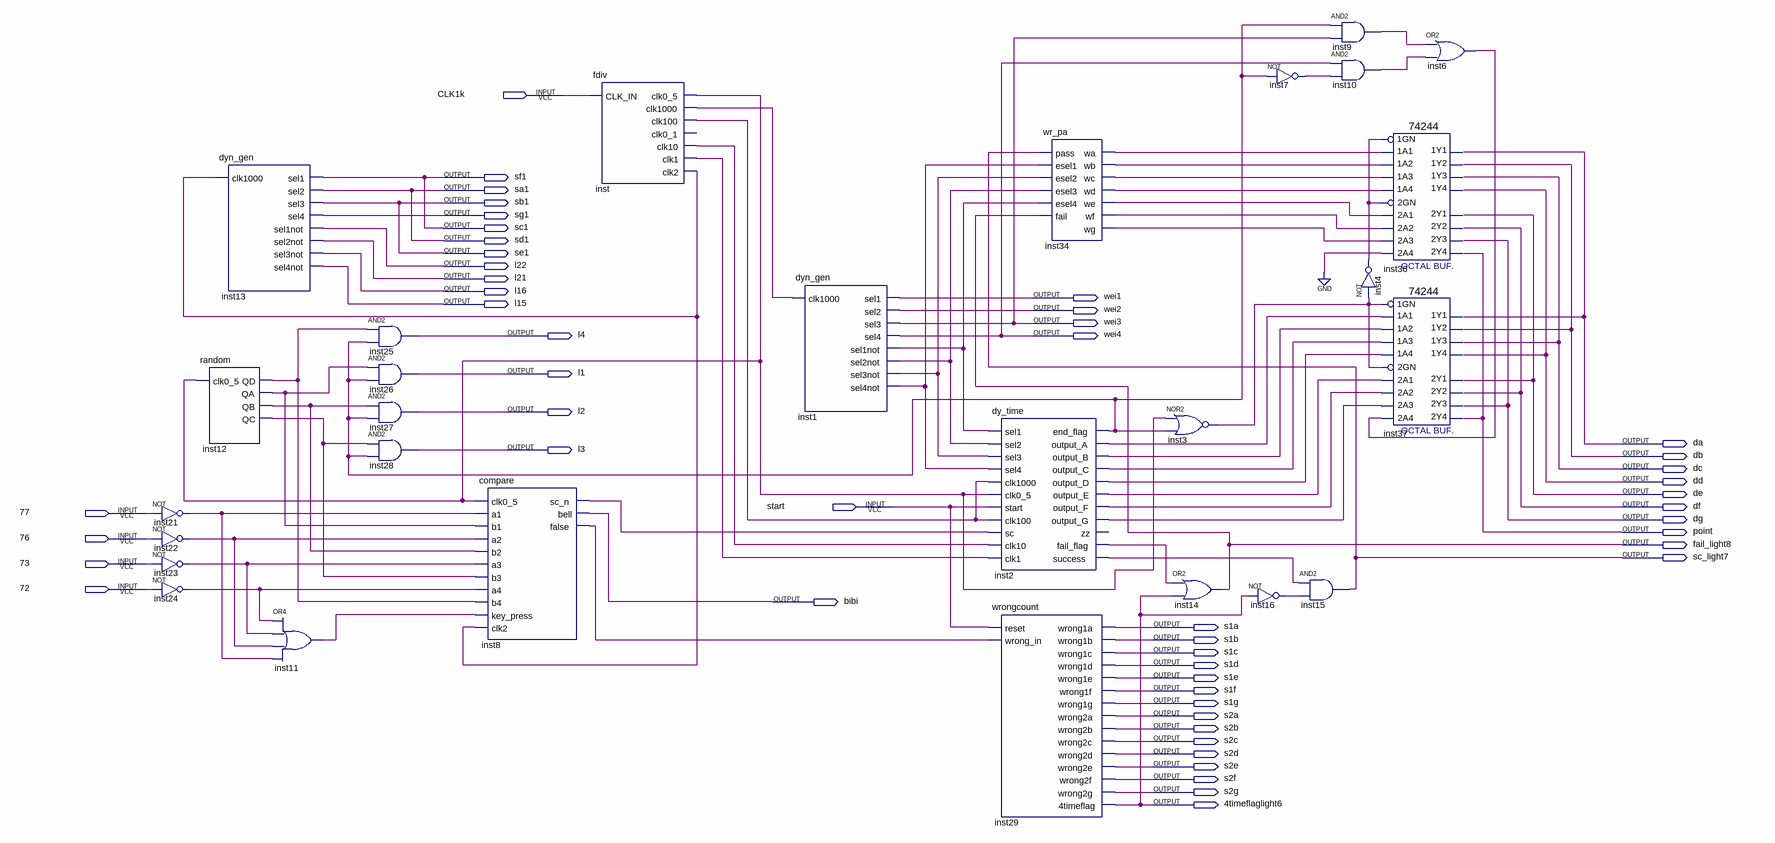
[diagram p0: schematic sheet]
// Quartus schematic main.bdf as structural Verilog: 28 symbols, 51 pins
module main (
  input  CLK1k,
  input  start,
  input  \77 ,
  input  \76 ,
  input  \73 ,
  input  \72 ,
  output sf1,
  output sa1,
  output sb1,
  output sg1,
  output sc1,
  output sd1,
  output se1,
  output l22,
  output l21,
  output l16,
  output wei1,
  output l15,
  output wei2,
  output wei3,
  output l4,
  output wei4,
  output l1,
  output l2,
  output da,
  output l3,
  output db,
  output dc,
  output dd,
  output de,
  output df,
  output dg,
  output point,
  output fail_light8,
  output sc_light7,
  output bibi,
  output s1a,
  output s1b,
  output s1c,
  output s1d,
  output s1e,
  output s1f,
  output s1g,
  output s2a,
  output s2b,
  output s2c,
  output s2d,
  output s2e,
  output s2f,
  output s2g,
  output \4timeflaglight6 
);

  wire inst1_sel1not, inst1_sel2not, inst1_sel3not, inst1_sel4not, inst2_end_flag, inst2_fail_flag,
       inst2_output_a, inst2_output_b, inst2_output_c, inst2_output_d, inst2_output_e, inst2_output_f,
       inst2_output_g, inst2_success, inst3_out, inst4_out, inst6_out, inst7_out, inst8_false, inst8_sc_n,
       inst9_out, inst10_out, inst11_out, inst12_qa, inst12_qb, inst12_qc, inst12_qd, inst16_out, inst21_out,
       inst22_out, inst23_out, inst24_out, inst34_wa, inst34_wb, inst34_wc, inst34_wd, inst34_we, inst34_wf,
       inst34_wg, inst_clk0_5, inst_clk1, inst_clk2, inst_clk10, inst_clk100, inst_clk1000;

  not inst21 (inst21_out, \77 );
  not inst22 (inst22_out, \76 );
  not inst23 (inst23_out, \73 );
  not inst24 (inst24_out, \72 );
  dyn_gen inst13 (
    .clk1000(inst_clk2), .sel1(sc1), .sel2(sa1), .sel3(sb1), .sel4(sg1), .sel1not(l22), .sel2not(l21),
    .sel3not(l16), .sel4not(l15));
  random inst12 (.clk0_5(inst_clk0_5), .QD(inst12_qd), .QA(inst12_qa), .QB(inst12_qb), .QC(inst12_qc));
  or inst11 (inst11_out, inst24_out, inst23_out, inst22_out, inst21_out);
  and inst25 (l4, inst12_qd, inst2_end_flag);
  and inst26 (l1, inst12_qa, inst2_end_flag);
  and inst27 (l2, inst12_qb, inst2_end_flag);
  and inst28 (l3, inst12_qc, inst2_end_flag);
  compare inst8 (
    .clk0_5(inst_clk0_5), .a1(inst21_out), .b1(inst12_qa), .a2(inst22_out), .b2(inst12_qb), .a3(inst23_out),
    .b3(inst12_qc), .a4(inst24_out), .b4(inst12_qd), .key_press(inst11_out), .clk2(inst_clk2),
    .sc_n(inst8_sc_n), .bell(bibi), .false(inst8_false));
  fdiv inst (
    .CLK_IN(CLK1k), .clk0_5(inst_clk0_5), .clk1000(inst_clk1000), .clk100(inst_clk100), .clk10(inst_clk10),
    .clk1(inst_clk1), .clk2(inst_clk2));  // open: clk0_1
  dyn_gen inst1 (
    .clk1000(inst_clk1000), .sel1(wei1), .sel2(wei2), .sel3(wei3), .sel4(wei4), .sel1not(inst1_sel1not),
    .sel2not(inst1_sel2not), .sel3not(inst1_sel3not), .sel4not(inst1_sel4not));
  dy_time inst2 (
    .sel1(inst1_sel1not), .sel2(inst1_sel2not), .sel3(inst1_sel3not), .sel4(inst1_sel4not),
    .clk1000(inst_clk100), .clk0_5(inst_clk0_5), .start(start), .clk100(inst_clk100), .sc(inst8_sc_n),
    .clk10(inst_clk10), .clk1(inst_clk1), .end_flag(inst2_end_flag), .output_A(inst2_output_a),
    .output_B(inst2_output_b), .output_C(inst2_output_c), .output_D(inst2_output_d),
    .output_E(inst2_output_e), .output_F(inst2_output_f), .output_G(inst2_output_g),
    .fail_flag(inst2_fail_flag), .success(inst2_success));  // open: zz
  wrongcount inst29 (
    .reset(start), .wrong_in(inst8_false), .wrong1a(s1a), .wrong1b(s1b), .wrong1c(s1c), .wrong1d(s1d),
    .wrong1e(s1e), .wrong1f(s1f), .wrong1g(s1g), .wrong2a(s2a), .wrong2b(s2b), .wrong2c(s2c), .wrong2d(s2d),
    .wrong2e(s2e), .wrong2f(s2f), .wrong2g(s2g), .\4timeflag (\4timeflaglight6 ));
  wr_pa inst34 (
    .pass(sc_light7), .esel1(inst1_sel4not), .esel2(inst1_sel3not), .esel3(inst1_sel2not),
    .esel4(inst1_sel1not), .fail(fail_light8), .wa(inst34_wa), .wb(inst34_wb), .wc(inst34_wc),
    .wd(inst34_wd), .we(inst34_we), .wf(inst34_wf), .wg(inst34_wg));
  nor inst3 (inst3_out, inst_clk0_5, inst2_end_flag);
  or inst14 (fail_light8, inst2_fail_flag, \4timeflaglight6 );
  not inst7 (inst7_out, inst2_end_flag);
  not inst16 (inst16_out, \4timeflaglight6 );
  and inst9 (inst9_out, inst2_end_flag, wei3);
  and inst10 (inst10_out, wei4, inst7_out);
  and inst15 (sc_light7, inst2_success, inst16_out);
  \74244  inst36 (
    .\1A2 (inst34_wb), .\1A4 (inst34_wd), .\1A1 (inst34_wa), .\1A3 (inst34_wc), .\1GN (inst4_out),
    .\2A3 (inst34_wg), .\2GN (inst4_out), .\2A1 (inst34_we), .\2A4 (1'b0), .\2A2 (inst34_wf), .\1Y2 (db),
    .\1Y4 (dd), .\2Y1 (de), .\1Y1 (da), .\2Y3 (dg), .\2Y4 (point), .\1Y3 (dc), .\2Y2 (df));
  not inst4 (inst4_out, inst3_out);
  \74244  inst37 (
    .\1A2 (inst2_output_b), .\1A4 (inst2_output_d), .\1A1 (inst2_output_a), .\1A3 (inst2_output_c),
    .\1GN (inst3_out), .\2A3 (inst2_output_g), .\2GN (inst3_out), .\2A1 (inst2_output_e), .\2A4 (inst6_out),
    .\2A2 (inst2_output_f), .\1Y2 (db), .\1Y4 (dd), .\2Y1 (de), .\1Y1 (da), .\2Y3 (dg), .\2Y4 (point),
    .\1Y3 (dc), .\2Y2 (df));
  or inst6 (inst6_out, inst9_out, inst10_out);

  assign sd1 = sa1;
  assign se1 = sb1;
  assign sf1 = sc1;
endmodule
